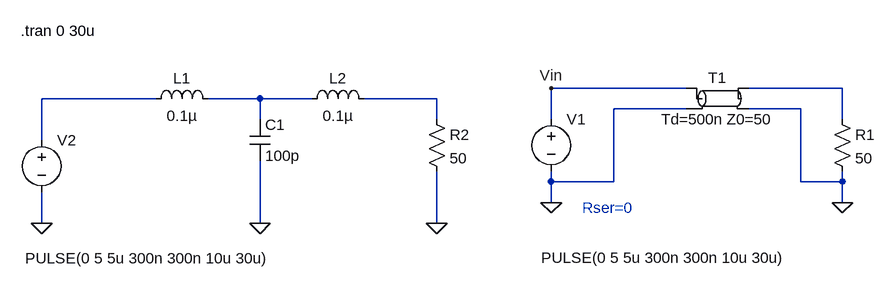
[diagram p0: schematic test_DC.asc]
test_DC.asc, the LTspice schematic file:
Version 4
SHEET 1 880 680
WIRE -112 64 -320 64
WIRE 128 64 -16 64
WIRE -928 80 -1104 80
WIRE -768 80 -848 80
WIRE -688 80 -768 80
WIRE -496 80 -608 80
WIRE -112 96 -224 96
WIRE 64 96 -16 96
WIRE -768 112 -768 80
WIRE -496 112 -496 80
WIRE -320 112 -320 64
WIRE 128 112 128 64
WIRE -1104 144 -1104 80
WIRE -320 208 -320 192
WIRE -224 208 -224 96
WIRE -224 208 -320 208
WIRE 64 208 64 96
WIRE 128 208 128 192
WIRE 128 208 64 208
WIRE -320 240 -320 208
WIRE 128 240 128 208
WIRE -1104 272 -1104 224
WIRE -768 272 -768 176
WIRE -496 272 -496 192
FLAG -320 240 0
FLAG 128 240 0
FLAG -320 64 Vin
FLAG -1104 272 0
FLAG -768 272 0
FLAG -496 272 0
SYMBOL voltage -320 96 R0
WINDOW 3 -15 229 Left 2
SYMATTR InstName V1
SYMATTR Value PULSE(0 5 5u 300n 300n 10u 30u)
SYMBOL tline -64 80 R0
SYMATTR InstName T1
SYMATTR Value Td=500n Z0=50
SYMBOL res 112 96 R0
SYMATTR InstName R1
SYMATTR Value 50
SYMBOL voltage -1104 128 R0
WINDOW 3 -25 198 Left 2
SYMATTR InstName V2
SYMATTR Value PULSE(0 5 5u 300n 300n 10u 30u)
SYMBOL ind -944 96 R270
WINDOW 0 32 56 VTop 2
WINDOW 3 5 56 VBottom 2
SYMATTR InstName L1
SYMATTR Value 0.1µ
SYMBOL ind -704 96 R270
WINDOW 0 32 56 VTop 2
WINDOW 3 5 56 VBottom 2
SYMATTR InstName L2
SYMATTR Value 0.1µ
SYMBOL cap -784 112 R0
SYMATTR InstName C1
SYMATTR Value 100p
SYMBOL res -512 96 R0
SYMATTR InstName R2
SYMATTR Value 50
TEXT -1136 -24 Left 2 !.tran 0 30u
TEXT -272 248 Left 2 ;Rser=0

The netlist it stands for:
* test_DC.asc
V1 Vin 0 PULSE(0 5 5u 300n 300n 10u 30u)
T1 Vin 0 N001 0 Td=500n Z0=50
R1 N001 0 50
V2 N002 0 PULSE(0 5 5u 300n 300n 10u 30u)
L1 N002 N003 0.1µ
L2 N003 N004 0.1µ
C1 N003 0 100p
R2 N004 0 50
.tran 0 30u
* Rser=0
.backanno
.end